# Altium schematic sheet RGB_Matrix.SchDoc
size A
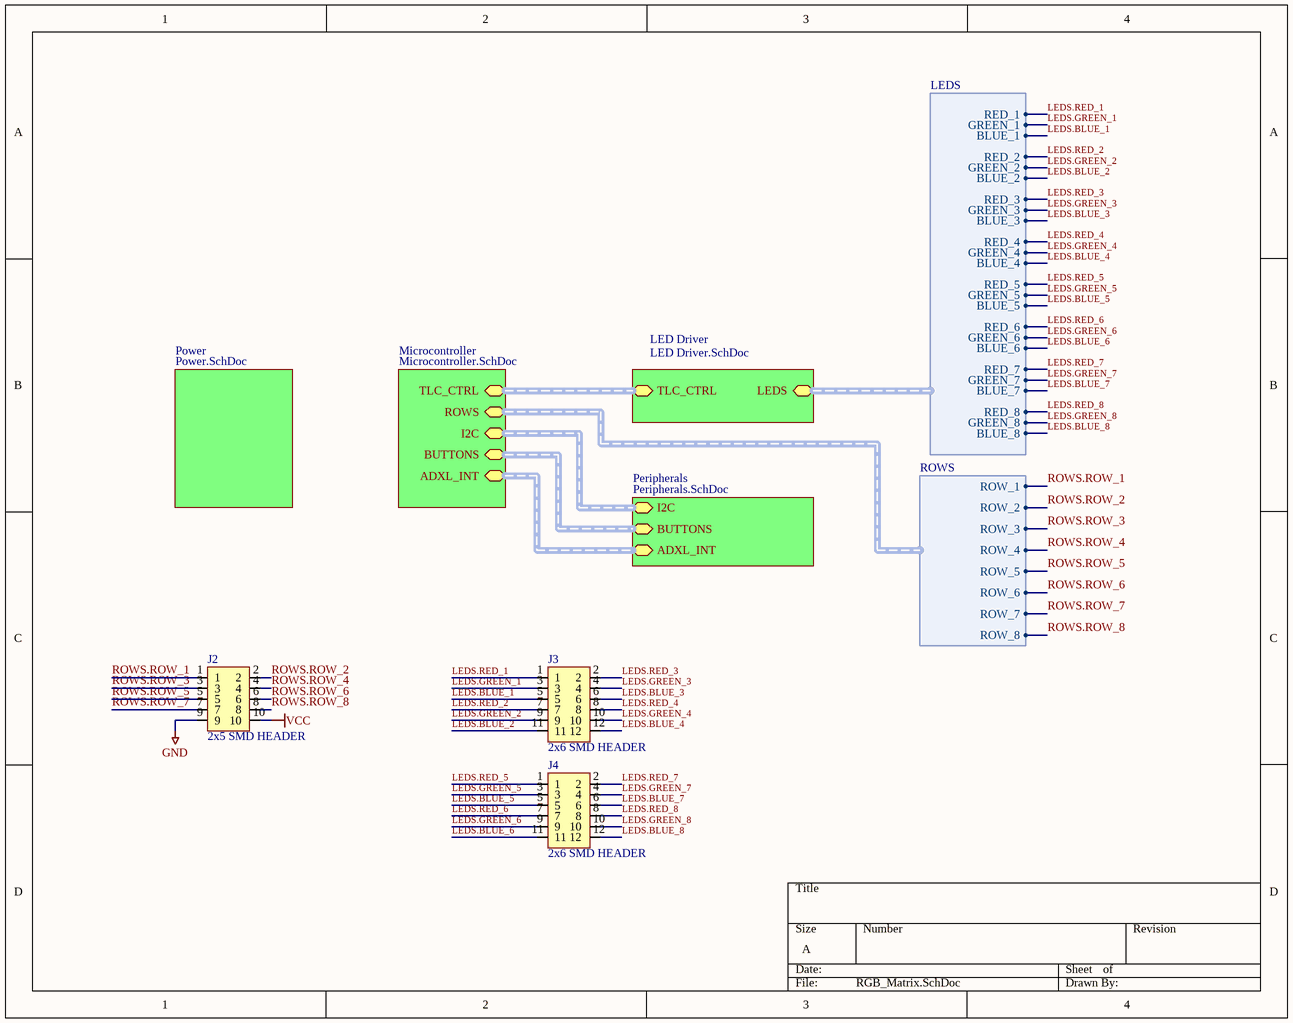
[diagram p0: RGB_Matrix.SchDoc]

## Parts
J2  2x5 SMD HEADER  [2x5 SMD HEADER]
J3  2x6 SMD HEADER  [2x6 SMD HEADER]
J4  2x6 SMD HEADER  [2x6 SMD HEADER]

## Sub-sheets
LED Driver = LED Driver.SchDoc: TLC_CTRL (harness TLC_CTRL), LEDS (harness LEDS)
Microcontroller = Microcontroller.SchDoc: TLC_CTRL (harness TLC_CTRL), ROWS (harness ROWS), I2C (harness I2C), ADXL_INT (harness ADXL_INT), BUTTONS (harness BUTTONS)
Peripherals = Peripherals.SchDoc: I2C (harness I2C), ADXL_INT (harness ADXL_INT), BUTTONS (harness BUTTONS)
Power = Power.SchDoc: no entries

## Harnesses
LEDS: BLUE_1, BLUE_2, BLUE_3, BLUE_4, BLUE_5, BLUE_6, BLUE_7, GREEN_1, GREEN_2, GREEN_3, GREEN_4, GREEN_5, GREEN_6, GREEN_7, GREEN_8, RED_1, RED_2, RED_3, RED_4, RED_5, RED_6, RED_7, RED_8, BLUE_8
ROWS: ROW_1, ROW_2, ROW_3, ROW_4, ROW_5, ROW_6, ROW_7, ROW_8

## Nets
GND: J2.9
VCC: J2.10
LEDS.BLUE_1: J3.5 ; sheet LED Driver/LEDS.BLUE_1
LEDS.BLUE_2: J3.11 ; sheet LED Driver/LEDS.BLUE_2
LEDS.BLUE_3: J3.6 ; sheet LED Driver/LEDS.BLUE_3
LEDS.BLUE_4: J3.12 ; sheet LED Driver/LEDS.BLUE_4
LEDS.BLUE_5: J4.5 ; sheet LED Driver/LEDS.BLUE_5
LEDS.BLUE_6: J4.11 ; sheet LED Driver/LEDS.BLUE_6
LEDS.BLUE_7: J4.6 ; sheet LED Driver/LEDS.BLUE_7
LEDS.BLUE_8: J4.12 ; sheet LED Driver/LEDS.BLUE_8
LEDS.GREEN_1: J3.3 ; sheet LED Driver/LEDS.GREEN_1
LEDS.GREEN_2: J3.9 ; sheet LED Driver/LEDS.GREEN_2
LEDS.GREEN_3: J3.4 ; sheet LED Driver/LEDS.GREEN_3
LEDS.GREEN_4: J3.10 ; sheet LED Driver/LEDS.GREEN_4
LEDS.GREEN_5: J4.3 ; sheet LED Driver/LEDS.GREEN_5
LEDS.GREEN_6: J4.9 ; sheet LED Driver/LEDS.GREEN_6
LEDS.GREEN_7: J4.4 ; sheet LED Driver/LEDS.GREEN_7
LEDS.GREEN_8: J4.10 ; sheet LED Driver/LEDS.GREEN_8
LEDS.RED_1: J3.1 ; sheet LED Driver/LEDS.RED_1
LEDS.RED_2: J3.7 ; sheet LED Driver/LEDS.RED_2
LEDS.RED_3: J3.2 ; sheet LED Driver/LEDS.RED_3
LEDS.RED_4: J3.8 ; sheet LED Driver/LEDS.RED_4
LEDS.RED_5: J4.1 ; sheet LED Driver/LEDS.RED_5
LEDS.RED_6: J4.7 ; sheet LED Driver/LEDS.RED_6
LEDS.RED_7: J4.2 ; sheet LED Driver/LEDS.RED_7
LEDS.RED_8: J4.8 ; sheet LED Driver/LEDS.RED_8
ROWS.ROW_1: J2.1 ; sheet Microcontroller/ROWS.ROW_1
ROWS.ROW_2: J2.2 ; sheet Microcontroller/ROWS.ROW_2
ROWS.ROW_3: J2.3 ; sheet Microcontroller/ROWS.ROW_3
ROWS.ROW_4: J2.4 ; sheet Microcontroller/ROWS.ROW_4
ROWS.ROW_5: J2.5 ; sheet Microcontroller/ROWS.ROW_5
ROWS.ROW_6: J2.6 ; sheet Microcontroller/ROWS.ROW_6
ROWS.ROW_7: J2.7 ; sheet Microcontroller/ROWS.ROW_7
ROWS.ROW_8: J2.8 ; sheet Microcontroller/ROWS.ROW_8

## Buses and harness runs
harness sheet LED Driver/TLC_CTRL = sheet Microcontroller/TLC_CTRL
harness sheet Microcontroller/ADXL_INT = sheet Peripherals/ADXL_INT
harness sheet Microcontroller/BUTTONS = sheet Peripherals/BUTTONS
harness sheet Microcontroller/I2C = sheet Peripherals/I2C